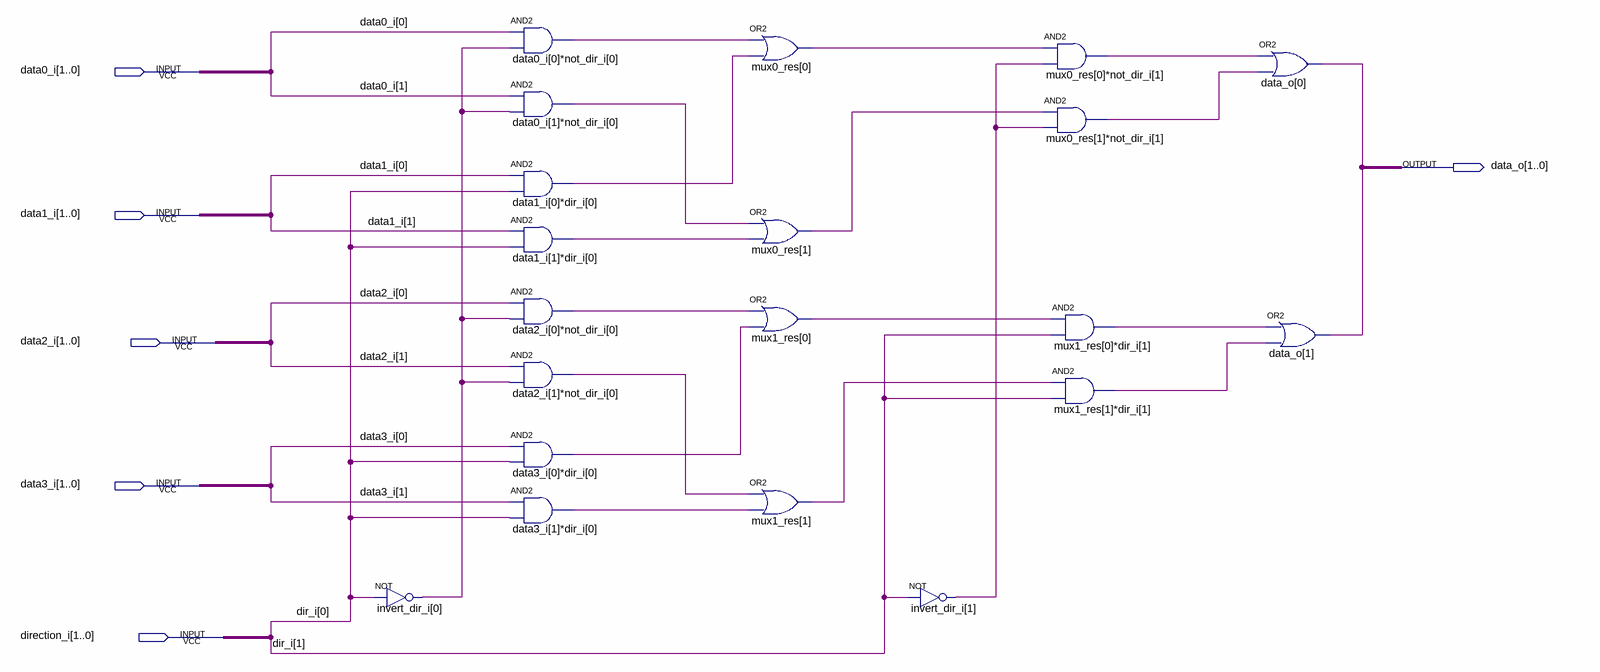
[diagram p0: schematic sheet]
// Quartus schematic top_tb.bdf as structural Verilog: 20 symbols, 6 pins
module top_tb (
  input  [1:0] data0_i,
  input  [1:0] data1_i,
  input  [1:0] data2_i,
  input  [1:0] data3_i,
  input  [1:0] direction_i,
  output [1:0] data_o
);

  wire data0_i_0__not_dir_i_0__out, data0_i_1__not_dir_i_0__out, data1_i_0__dir_i_0__out,
       data1_i_1__dir_i_0__out, data2_i_0__not_dir_i_0__out, data2_i_1__not_dir_i_0__out,
       data3_i_0__dir_i_0__out, data3_i_1__dir_i_0__out, data_o_0__out, invert_dir_i_0__out,
       invert_dir_i_1__out, mux0_res_0__not_dir_i_1__out, mux0_res_0__out, mux0_res_1__not_dir_i_1__out,
       mux0_res_1__out, mux1_res_0__dir_i_1__out, mux1_res_0__out, mux1_res_1__dir_i_1__out, mux1_res_1__out;
  wire [1:0] dir_i;

  not \invert_dir_i[0]  (invert_dir_i_0__out, dir_i[0]);
  and \data0_i[0]*not_dir_i[0]  (data0_i_0__not_dir_i_0__out, data0_i[0], invert_dir_i_0__out);
  and \data0_i[1]*not_dir_i[0]  (data0_i_1__not_dir_i_0__out, data0_i[1], invert_dir_i_0__out);
  and \data1_i[0]*dir_i[0]  (data1_i_0__dir_i_0__out, data1_i[0], dir_i[0]);
  and \data1_i[1]*dir_i[0]  (data1_i_1__dir_i_0__out, data1_i[1], dir_i[0]);
  and \data2_i[0]*not_dir_i[0]  (data2_i_0__not_dir_i_0__out, data2_i[0], invert_dir_i_0__out);
  and \data2_i[1]*not_dir_i[0]  (data2_i_1__not_dir_i_0__out, data2_i[1], invert_dir_i_0__out);
  and \data3_i[0]*dir_i[0]  (data3_i_0__dir_i_0__out, data3_i[0], dir_i[0]);
  and \data3_i[1]*dir_i[0]  (data3_i_1__dir_i_0__out, data3_i[1], dir_i[0]);
  or \mux0_res[0]  (mux0_res_0__out, data0_i_0__not_dir_i_0__out, data1_i_0__dir_i_0__out);
  or \mux0_res[1]  (mux0_res_1__out, data0_i_1__not_dir_i_0__out, data1_i_1__dir_i_0__out);
  or \mux1_res[0]  (mux1_res_0__out, data2_i_0__not_dir_i_0__out, data3_i_0__dir_i_0__out);
  or \mux1_res[1]  (mux1_res_1__out, data2_i_1__not_dir_i_0__out, data3_i_1__dir_i_0__out);
  not \invert_dir_i[1]  (invert_dir_i_1__out, dir_i[1]);
  and \mux0_res[0]*not_dir_i[1]  (mux0_res_0__not_dir_i_1__out, mux0_res_0__out, invert_dir_i_1__out);
  and \mux0_res[1]*not_dir_i[1]  (mux0_res_1__not_dir_i_1__out, mux0_res_1__out, invert_dir_i_1__out);
  and \mux1_res[0]*dir_i[1]  (mux1_res_0__dir_i_1__out, mux1_res_0__out, dir_i[1]);
  and \mux1_res[1]*dir_i[1]  (mux1_res_1__dir_i_1__out, mux1_res_1__out, dir_i[1]);
  or \data_o[0]  (data_o_0__out, mux0_res_0__not_dir_i_1__out, mux0_res_1__not_dir_i_1__out);
  or \data_o[1]  (data_o_0__out, mux1_res_0__dir_i_1__out, mux1_res_1__dir_i_1__out);
endmodule
